# Altium schematic sheet [07]-PowerSupply.SchDoc: Powersupplies (part 2 of 4)
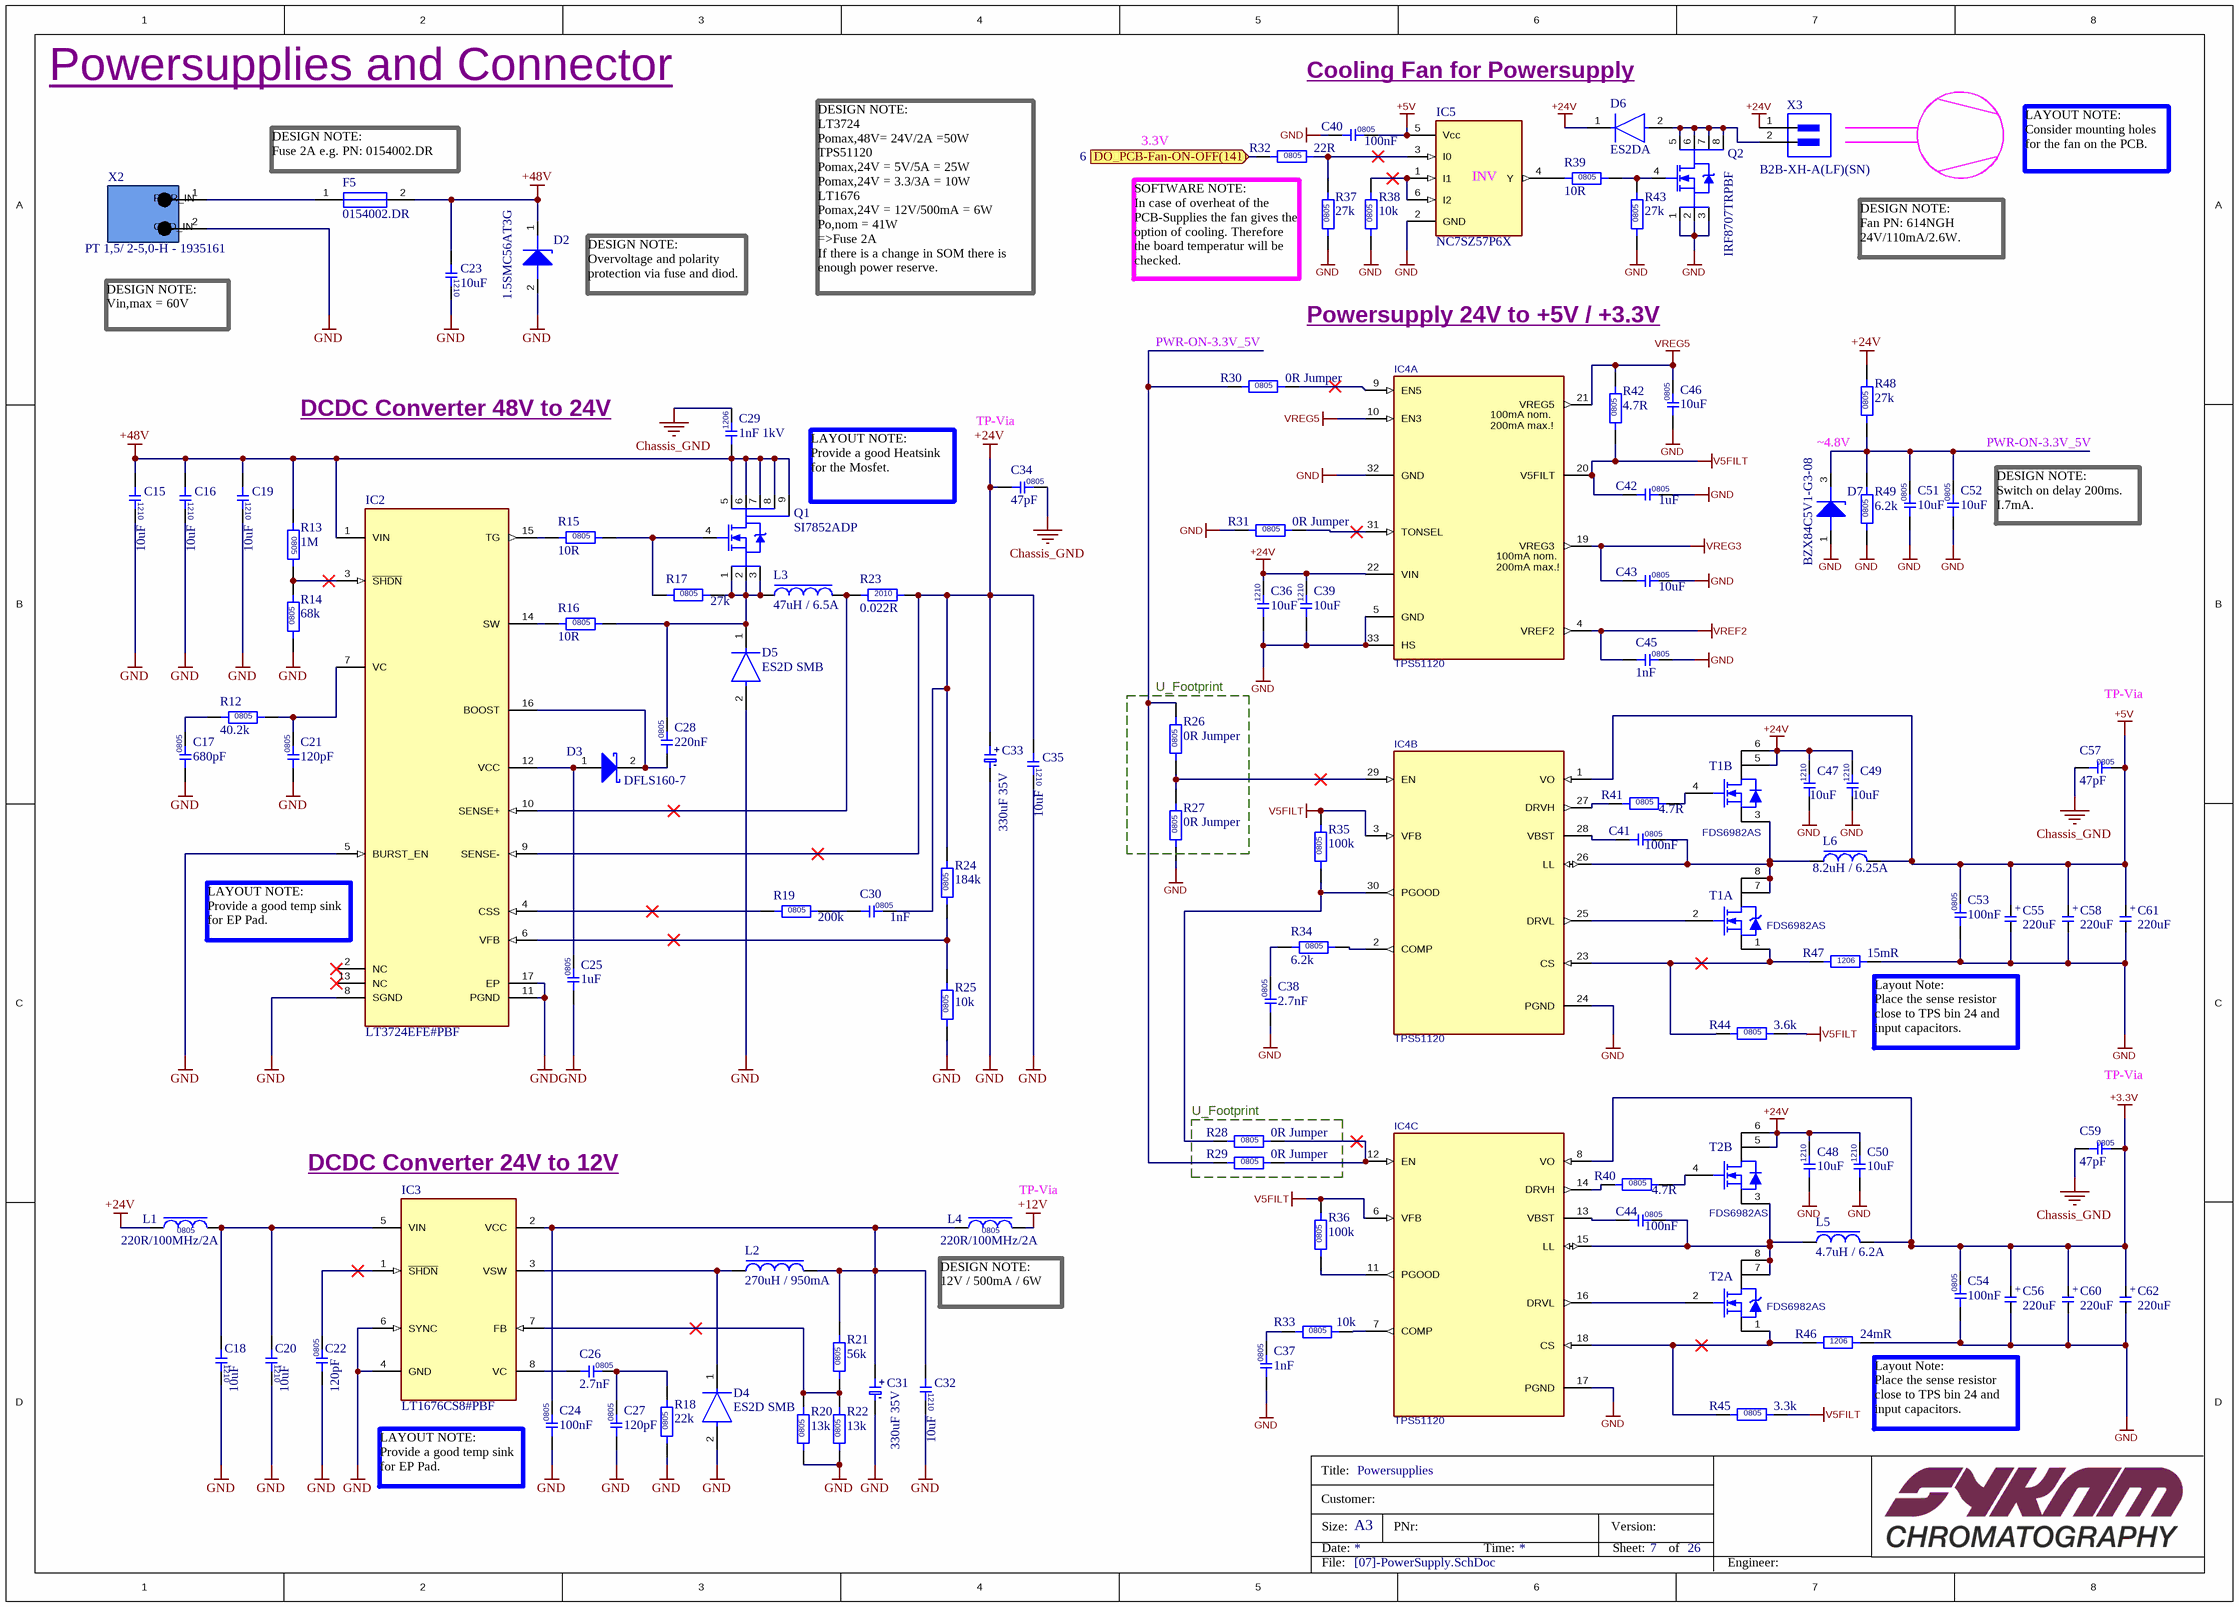
[diagram p1: [07]-PowerSupply.SchDoc]
## Library data of the parts
C15 C16 C18-C20 C23 C32 C35 C36 C39 C47-C50 = C_10uF_C1210C106K5RACTU: CAP CER 10UF 50V X7R 1210; Manufacturer: KEMET; Dielectric Material: Ceramic; Tolerance: 10%; Supplier 1: Digi-Key; Manufacturer Part Number: C1210C106K5RACTU; RoHS: Yes; Category: Ceramic Capacitors; Stock 1: 21988; Pricing 1: 1=0,90000, 10=0,66400, 100=0,45540, 500=0,36052 (USD); Mount: Surface Mount; Case/Package: 1210; Weight: 0.000564oz; Case Code (Metric): 3225; Case Code (Imperial): 1210; Min Operating Temperature: -55°C; Max Operating Temperature: 125°C; Packaging: Tape and Reel; Voltage Rating: 50V; Voltage: 50V; Dielectric: X7R; Termination: SMD/SMT; Voltage Rating (DC): 50V; Package Quantity: 1000; Capacitance: 10uF; Length: 3.2mm; Height: 2.5mm; Width: 2.5mm; Thickness: 0.11inch; Depth: 2.5mm; REACH SVHC: No SVHC; ComponentLink1URL: http://www.mouser.com/ds/2/212/KEM_C1002_X7R_SMD-357932.pdf?src-supplier=Mouser; ComponentLink1Description: http://www.mouser.com/ds/2/212/KEM_C1002_X7R_SMD-357932.pdf?src-supplier=Mouser; ComponentLink2URL: http://uk.rs-online.com/webdocs/1515/0900766b8151523b.pdf?src-supplier=RSComponents; ComponentLink2Description: http://uk.rs-online.com/webdocs/1515/0900766b8151523b.pdf?src-supplier=RSComponents; ComponentLink3URL: http://www.farnell.com/datasheets/2740742.pdf?src-supplier=Farnell; ComponentLink3Description: http://www.farnell.com/datasheets/2740742.pdf?src-supplier=Farnell; ComponentLink4URL: https://api.kemet.com/component-edge/download/datasheet/C1210C106K5RACTU.pdf?src-supplier=Digi-Key; ComponentLink4Description: https://api.kemet.com/component-edge/download/datasheet/C1210C106K5RACTU.pdf?src-supplier=Digi-Key; ComponentLink5URL: http://capacitoredge.kemet.com/capedge2/DataSheet/Datasheet-C0402C471J3GACTU.pdf?pn=C1210C106K5RACTU&src-supplier=Avnet; ComponentLink5Description: http://capacitoredge.kemet.com/capedge2/DataSheet/Datasheet-C0402C471J3GACTU.pdf?pn=C1210C106K5RACTU&src-supplier=Avnet; ComponentLink6URL: http://www.farnell.com/datasheets/2740742.pdf?src-supplier=Element14; ComponentLink6Description: http://www.farnell.com/datasheets/2740742.pdf?src-supplier=Element14; ComponentLink7URL: http://capacitoredge.kemet.com/capedge2/DataSheet/Datasheet-C1210C106K5RACTU.pdf?pn=C1210C106K5RACTU&src-supplier=Avnet; ComponentLink7Description: http://capacitoredge.kemet.com/capedge2/DataSheet/Datasheet-C1210C106K5RACTU.pdf?pn=C1210C106K5RACTU&src-supplier=Avnet; ComponentLink8URL: http://www.farnell.com/datasheets/1886292.pdf?src-supplier=Newark; ComponentLink8Description: http://www.farnell.com/datasheets/1886292.pdf?src-supplier=Newark; ComponentLink9URL: http://www.farnell.com/datasheets/2740742.pdf?src-supplier=Newark; ComponentLink9Description: http://www.farnell.com/datasheets/2740742.pdf?src-supplier=Newark; Supplier Part Number 1: 399-11629-1-ND
C17 = C_680pF_C0805C681K5RACTU: Cap Ceramic 680pF 50V X7R 10% SMD 0805 125C T/R; Manufacturer: KEMET; Dissipation Factor: 2.5%; Supplier 1: Farnell; Manufacturer Part Number: C0805C681K5RACTU; RoHS: Yes; Category: Ceramic Capacitors; Stock 1: 3684; Pricing 1: 10=0,16600, 100=0,10900, 500=0,07040, 1000=0,06490, 2000=0,05190 (EUR); Mount: Surface Mount,PCB; Case/Package: 0805; Case Code (Imperial): 0805; Case Code (Metric): 2012; Dielectric Material: Ceramic; Min Operating Temperature: -55°C; Max Operating Temperature: 125°C; Capacitance: 680pF; Tolerance: 10%; Packaging: Tape and Reel; Package Quantity: 1; Dielectric: X7R; Voltage Rating (DC): 50V; Termination: SMD/SMT; Voltage Rating: 50V; Voltage: 50V; Length: 2mm; Width: 1.2mm; Height: 0.78mm; Depth: 1.25mm; Thickness: 0.035inch; Lead Pitch: 0.75mm; Radiation Hardening: No; REACH SVHC: No SVHC; ComponentLink1URL: https://datasheet.ciiva.com/5424/kem-c1002-x7r-smd-357932-5424613.pdf?src-supplier=Mouser; ComponentLink1Description: https://datasheet.ciiva.com/5424/kem-c1002-x7r-smd-357932-5424613.pdf?src-supplier=Mouser; ComponentLink2URL: https://datasheet.ciiva.com/14598/70095383-14598986.pdf?src-supplier=Allied+Electronics; ComponentLink2Description: https://datasheet.ciiva.com/14598/70095383-14598986.pdf?src-supplier=Allied+Electronics; Supplier Part Number 1: 2581098
C21 C22 C27 = C_120pF_08055C121KAT2A: Cap Ceramic 120pF 50V X7R 10% SMD 0805 125C T/R; Manufacturer: Kyocera AVX; Supplier 1: Mouser; Manufacturer Part Number: 08055C121KAT2A; RoHS: Yes; Category: Ceramic Capacitors; Stock 1: 17744; Mount: Surface Mount; Case/Package: 0805; Number of Pins: 2; Case Code (Metric): 2012; Case Code (Imperial): 0805; Weight: 0.000194oz; Min Operating Temperature: -55°C; Max Operating Temperature: 125°C; Package Quantity: 4000; Capacitance: 120pF; Tolerance: 10%; Packaging: Tape and Reel; Voltage Rating (DC): 50V; Dielectric: X7R; Termination: SMD/SMT; Voltage Rating: 50V; Length: 2.01mm; Width: 0.049inch; Depth: 1.25mm; Thickness: 0.037inch; Lead Free: Lead Free; REACH SVHC: Unknown; ComponentLink1URL: https://datasheet.ciiva.com/205/cx7r-205216.pdf?src-supplier=Digi-Key; ComponentLink1Description: https://datasheet.ciiva.com/205/cx7r-205216.pdf?src-supplier=Digi-Key; Supplier Part Number 1: 581-08055C121KAT2A
C24 C40 C41 C44 C53 C54 = C_100nF_CC0805KRX7R9BB104: CAP CER 0.1UF 50V X7R 0805; Manufacturer: Yageo; Material: Ceramic; Tolerance: 10%; Insulation Resistance: 100GR; PCBChecked: initials after Checked; Supplier 1: Digi-Key; Manufacturer Part Number: CC0805KRX7R9BB104; RoHS: Yes; Category: Ceramic Capacitors; Mount: Surface Mount; Case/Package: 0805; Number of Pins: 2; Case Code (Metric): 2012; Case Code (Imperial): 0805; Min Operating Temperature: -55°C; Max Operating Temperature: 125°C; Packaging: Tape and Reel; Capacitance: 100nF; Voltage Rating: 50V; Package Quantity: 1; Dielectric: X7R; Termination: SMD/SMT; Voltage: 50V; Length: 2mm; Height: 0.85mm; Width: 0.049inch; Thickness: 0.033inch; Depth: 1.25mm; Radiation Hardening: No; REACH SVHC: No SVHC; Lead Free: Lead Free; Halogen Free: Halogen Free; ComponentLink1URL: https://datasheet.ciiva.com/11786/0900766b80d84f1d-11786009.pdf?src-supplier=RSComponents; ComponentLink1Description: https://datasheet.ciiva.com/11786/0900766b80d84f1d-11786009.pdf?src-supplier=RSComponents; ComponentLink2URL: https://datasheet.ciiva.com/11464/upy-gphc-x7r-6-3v-to-50v-8-11464757.pdf?src-supplier=Avnet; ComponentLink2Description: https://datasheet.ciiva.com/11464/upy-gphc-x7r-6-3v-to-50v-8-11464757.pdf?src-supplier=Avnet; ComponentLink3URL: https://datasheet.ciiva.com/28450/1489800-28450805.pdf?src-supplier=Element14; ComponentLink3Description: https://datasheet.ciiva.com/28450/1489800-28450805.pdf?src-supplier=Element14; ComponentLink4URL: https://datasheet.ciiva.com/155/mlccorderingcode-155929.pdf?src-supplier=Digi-Key; ComponentLink4Description: https://datasheet.ciiva.com/155/mlccorderingcode-155929.pdf?src-supplier=Digi-Key; ComponentLink5URL: https://datasheet.ciiva.com/155/mlccorderingcode-155930.pdf?src-supplier=Digi-Key; ComponentLink5Description: https://datasheet.ciiva.com/155/mlccorderingcode-155930.pdf?src-supplier=Digi-Key; ComponentLink6URL: https://datasheet.ciiva.com/155/mlccorderingcode-155931.pdf?src-supplier=Digi-Key; ComponentLink6Description: https://datasheet.ciiva.com/155/mlccorderingcode-155931.pdf?src-supplier=Digi-Key; ComponentLink7URL: https://datasheet.ciiva.com/46393/1734573-46393307.pdf?src-supplier=Element14; ComponentLink7Description: https://datasheet.ciiva.com/46393/1734573-46393307.pdf?src-supplier=Element14; ComponentLink8URL: https://datasheet.ciiva.com/16625/upy-gphc-x7r-6-3v-to-50v-8-16625549.pdf?src-supplier=Avnet+Europe; ComponentLink8Description: https://datasheet.ciiva.com/16625/upy-gphc-x7r-6-3v-to-50v-8-16625549.pdf?src-supplier=Avnet+Europe; ComponentLink9URL: https://datasheet.ciiva.com/29242/445210-da-01-en-kerko-chip-0805-x7r-0-1uf-10proz-50vg-29242074.pdf?src-supplier=Conrad; ComponentLink9Description: https://datasheet.ciiva.com/29242/445210-da-01-en-kerko-chip-0805-x7r-0-1uf-10proz-50vg-29242074.pdf?src-supplier=Conrad; Supplier Part Number 1: 311-1140-6-ND; Stock 1: 7118979; IPC7352C: done; SCHChecked: Initials after checked
C25 C42 = C_1uF_CC0805KKX7R9BB105: Cap Ceramic 1uF 50V X7R 10% SMD 0805 125C Blister T/R; Manufacturer: Yageo; PCBChecked: initials after Checked; Supplier 1: Digi-Key; Manufacturer Part Number: CC0805KKX7R9BB105; RoHS: Yes; Category: Ceramic Capacitors; Mount: Surface Mount; Case/Package: 0805; Weight: 0.000194oz; Case Code (Imperial): 0805; Case Code (Metric): 2012; Min Operating Temperature: -55°C; Max Operating Temperature: 125°C; Tolerance: 10%; Dielectric: X7R; Packaging: Tape and Reel; Capacitance: 1uF; Voltage Rating: 50V; Voltage Rating (DC): 50V; Termination: SMD/SMT; Composition: Ceramic; Length: 2mm; Height: 1.25mm; Width: 0.049inch; Thickness: 0.057inch; Depth: 1.25mm; Radiation Hardening: No; Lead Free: Lead Free; Halogen Free: Halogen Free; ComponentLink1URL: https://datasheet.ciiva.com/13209/upy-gphc-x7r-6-3v-to-50v-8-12304-13209375.pdf?src-supplier=Mouser; ComponentLink1Description: https://datasheet.ciiva.com/13209/upy-gphc-x7r-6-3v-to-50v-8-12304-13209375.pdf?src-supplier=Mouser; Supplier Part Number 1: 311-1886-6-ND; Stock 1: 325114; IPC7352C: done; SCHChecked: Initials after checked
C26 C38 = C_2.7nF_C0805C272K5RACTU: KEMET         C0805C272K5RACTU             SMD Multilayer Ceramic Capacitor, 0805 [2012 Metric], 2700 pF, 50 V,  10%, X7R, C Series; Voltage Rating: 50V; Dissipation Factor: 2.5%; Supplier 1: Digi-Key; Manufacturer: KEMET; Manufacturer Part Number: C0805C272K5RACTU; RoHS: Yes; Category: Ceramic Capacitors; Stock 1: 17634; Pricing 1: 1=0,21000, 10=0,14200, 100=0,07210, 500=0,04934, 1000=0,04364 (USD); Mount: Surface Mount,PCB; Case/Package: 0805; Number of Pins: 2; Dielectric Material: Ceramic; Case Code (Imperial): 0805; Case Code (Metric): 2012; Min Operating Temperature: -55°C; Max Operating Temperature: 125°C; Capacitance: 2.7nF; Tolerance: 10%; Packaging: Tape and Reel; Voltage Rating (DC): 50V; Dielectric: X7R; Termination: SMD/SMT; Package Quantity: 4000; Voltage: 50V; Length: 2mm; Height: 0.78mm; Width: 1.2mm; Lead Pitch: 0.75mm; Depth: 1.25mm; Thickness: 0.035inch; Radiation Hardening: No; REACH SVHC: No SVHC; ComponentLink1URL: https://datasheet.ciiva.com/14589/70095383-14589404.pdf?src-supplier=Allied+Electronics; ComponentLink1Description: https://datasheet.ciiva.com/14589/70095383-14589404.pdf?src-supplier=Allied+Electronics; Supplier Part Number 1: 399-1152-1-ND
C28 = C_220nF_C0805C224K5RACTU: CAP CER 0.22UF 50V X7R 0805; Manufacturer: KEMET; Dielectric Material: Ceramic; Tolerance: 10%; Dissipation Factor: 2.5%; Supplier 1: Digi-Key; Manufacturer Part Number: C0805C224K5RACTU; RoHS: Yes; Category: Ceramic Capacitors; Stock 1: 1337737; Pricing 1: 1=0,20000, 10=0,13900, 100=0,06550, 500=0,04592, 1000=0,03802 (USD); Mount: Surface Mount,PCB; Case/Package: 0805; Case Code (Metric): 2012; Case Code (Imperial): 0805; Min Operating Temperature: -55°C; Max Operating Temperature: 125°C; Package Quantity: 1; Capacitance: 220nF; Voltage Rating: 50V; Packaging: Tape and Reel; Voltage Rating (DC): 50V; Dielectric: X7R; Termination: SMD/SMT; Voltage: 50V; Length: 2mm; Height: 1.1mm; Width: 0.049inch; Thickness: 0.055inch; Lead Pitch: 0.75mm; Depth: 1.25mm; Radiation Hardening: No; REACH SVHC: No SVHC; ComponentLink1URL: https://datasheet.ciiva.com/7842/kem-c1002-x7r-smd-7842582.pdf?src-supplier=Element14; ComponentLink1Description: https://datasheet.ciiva.com/7842/kem-c1002-x7r-smd-7842582.pdf?src-supplier=Element14; ComponentLink2URL: https://datasheet.ciiva.com/18193/getdatasheetpartid-304413-18193686.pdf?src-supplier=Verical; ComponentLink2Description: https://datasheet.ciiva.com/18193/getdatasheetpartid-304413-18193686.pdf?src-supplier=Verical; ComponentLink3URL: https://datasheet.ciiva.com/28682/1851736-28682316.pdf?src-supplier=Element14; ComponentLink3Description: https://datasheet.ciiva.com/28682/1851736-28682316.pdf?src-supplier=Element14; Supplier Part Number 1: 399-3491-1-ND
C29 = C_1nF-1kV-CGA5F1X7S3A102M085AE: CAP CER 1000PF 1KV X7S 1206; Manufacturer: TDK; Tolerance: 20%; Supplier 1: Mouser; Manufacturer Part Number: CGA5F1X7S3A102M085AE; RoHS: Yes; Category: Ceramic Capacitors; Stock 1: 11858; Pricing 1: 1=0,94000, 10=0,71800, 100=0,51400, 500=0,39800, 1000=0,34300, 4000=0,25700 (USD); Mount: Surface Mount; Case/Package: 1206; Weight: 0.000571oz; Case Code (Imperial): 1206; Case Code (Metric): 3216; Min Operating Temperature: -55°C; Max Operating Temperature: 125°C; Features: Soft Termination; Dielectric: X7S; Package Quantity: 4000; Packaging: Tape and Reel; Capacitance: 1nF; Voltage Rating: 1kV; Termination: SMD/SMT; Voltage Rating (DC): 1kV; Length: 0.126inch; Height: 0.85mm; Width: 0.063inch; Thickness: 0.039inch; Ratings: AEC-Q200; ComponentLink1URL: http://www.mouser.com/ds/2/400/lcc_commercial_soft_en-775842.pdf?src-supplier=Mouser; ComponentLink1Description: http://www.mouser.com/ds/2/400/lcc_commercial_soft_en-775842.pdf?src-supplier=Mouser; ComponentLink2URL: https://product.tdk.com/info/en/catalog/spec/mlccspec_automotive_highvoltage_en.pdf?src-supplier=Digi-Key; ComponentLink2Description: https://product.tdk.com/info/en/catalog/spec/mlccspec_automotive_highvoltage_en.pdf?src-supplier=Digi-Key; ComponentLink3URL: https://product.tdk.com/info/en/catalog/datasheets/mlcc_automotive_highvoltage_en.pdf?src-supplier=Digi-Key; ComponentLink3Description: https://product.tdk.com/info/en/catalog/datasheets/mlcc_automotive_highvoltage_en.pdf?src-supplier=Digi-Key; ComponentLink4URL: http://product.tdk.com/capacitor/mlcc/en/documents/mlcc_automotive_soft_en.pdf?src-supplier=Avnet; ComponentLink4Description: http://product.tdk.com/capacitor/mlcc/en/documents/mlcc_automotive_soft_en.pdf?src-supplier=Avnet; Supplier Part Number 1: 810-CGA5F1X7S3A102ME
C30 C37 C45 = C_1nF_C0805C102K5RAC7411: Multilayer Ceramic Capacitors MLCC - SMD/SMT 50volts 1000pF X7R 10%; Manufacturer: KEMET; Voltage Rating: 50V; Manufacturer Part Number: C0805C102K5RAC7411; RoHS: Yes; Category: Ceramic Capacitors; Stock 1: 30000; Pricing 1: 15000=0,01862, 30000=0,01764 (USD); Mount: Surface Mount; Case/Package: 0805; Case Code (Metric): 2012; Case Code (Imperial): 0805; Dielectric Material: Ceramic; Min Operating Temperature: -55°C; Max Operating Temperature: 125°C; Termination: SMD/SMT; Capacitance: 1nF; Package Quantity: 15000; Voltage Rating (DC): 50V; Tolerance: 10%; Packaging: Tape and Reel; Dielectric: X7R; Length: 0.079inch; Height: 0.78mm; Thickness: 0.035inch; Width: 0.049inch; ComponentLink1URL: http://components.arrow.com/part/dataview/0323_00324664?src-supplier=Arrow+Europe; ComponentLink1Description: http://components.arrow.com/part/dataview/0323_00324664?src-supplier=Arrow+Europe; ComponentLink2URL: http://www.mouser.com/ds/2/212/KEM_C1002_X7R_SMD-1102033.pdf?src-supplier=Mouser; ComponentLink2Description: http://www.mouser.com/ds/2/212/KEM_C1002_X7R_SMD-1102033.pdf?src-supplier=Mouser; ComponentLink3URL: https://api.kemet.com/component-edge/download/datasheet/C0805C102K5RAC7411.pdf?src-supplier=Digi-Key; ComponentLink3Description: https://api.kemet.com/component-edge/download/datasheet/C0805C102K5RAC7411.pdf?src-supplier=Digi-Key; Supplier 1: Digi-Key
  C30: Supplier Part Number 1: 311-1127-1-ND
  C37 C45: Supplier Part Number 1: 399-7361-2-ND
C31 C33 = C_330uF_35V_EEEFP1V331AP: GLOVE, POLYAMIDE, L/FREE, PU, SIZE 6 - More Details; Manufacturer: Panasonic; Material: Aluminium; Ripple Current: 1.19A; ESR (Equivalent Series Resistance): 60mR; Tolerance: 20%; Polarity: Polar; Leakage Current: 115.5uA; Life (Hours): 2000Hour; Supplier 1: Farnell; Manufacturer Part Number: EEEFP1V331AP; RoHS: Yes; Category: Aluminum Electrolytic Capacitors; Stock 1: 7000; Pricing 1: 500=0,24100, 2500=0,22600 (EUR); Mount: Surface Mount,PCB; Case/Package: Radial; Number of Pins: 2; Dielectric Material: Aluminium; Contact Plating: Tin; Min Operating Temperature: -55°C; Max Operating Temperature: 105°C; Capacitance: 330uF; Termination: SMD/SMT; Voltage: 35V; Voltage Rating: 35V; Ripple Current (AC): 1.19A; Packaging: Tape and Reel; Voltage Rating (DC): 35V; Package Quantity: 500; Diameter: 10mm; Length: 10.5mm; Width: 10.3mm; Height: 10.2mm; Height - Seated (Max): 0.402inch; Lead Pitch: 4.6mm; Radiation Hardening: No; REACH SVHC: No SVHC; Lead Free: Lead Free; ComponentLink1URL: https://datasheet.ciiva.com/25613/0900766b80df09a1-25613928.pdf?src-supplier=RSComponents; ComponentLink1Description: https://datasheet.ciiva.com/25613/0900766b80df09a1-25613928.pdf?src-supplier=RSComponents; ComponentLink2URL: https://datasheet.ciiva.com/11777/0900766b80df09a1-11777338.pdf?src-supplier=RSComponents; ComponentLink2Description: https://datasheet.ciiva.com/11777/0900766b80df09a1-11777338.pdf?src-supplier=RSComponents; ComponentLink3URL: https://datasheet.ciiva.com/29313/444849-da-01-en-smd-elko-eeefp1v331ap-330uf-35v-105-29313972.pdf?src-supplier=Conrad; ComponentLink3Description: https://datasheet.ciiva.com/29313/444849-da-01-en-smd-elko-eeefp1v331ap-330uf-35v-105-29313972.pdf?src-supplier=Conrad; ComponentLink4URL: https://datasheet.ciiva.com/14600/70068195-14600453.pdf?src-supplier=Allied+Electronics; ComponentLink4Description: https://datasheet.ciiva.com/14600/70068195-14600453.pdf?src-supplier=Allied+Electronics; ComponentLink5URL: https://datasheet.ciiva.com/30151/aba0000ce114-30151389.pdf?src-supplier=Onlinecomponents.com; ComponentLink5Description: https://datasheet.ciiva.com/30151/aba0000ce114-30151389.pdf?src-supplier=Onlinecomponents.com; ComponentLink6URL: https://datasheet.ciiva.com/2985/aba0000ce114-2985550.pdf?src-supplier=Avnet; ComponentLink6Description: https://datasheet.ciiva.com/2985/aba0000ce114-2985550.pdf?src-supplier=Avnet; ComponentLink7URL: https://datasheet.ciiva.com/24028/aba0000ce114-40714-24028182.pdf?src-supplier=Mouser; ComponentLink7Description: https://datasheet.ciiva.com/24028/aba0000ce114-40714-24028182.pdf?src-supplier=Mouser; ComponentLink8URL: https://datasheet.ciiva.com/46386/370232-46386774.pdf?src-supplier=Element14; ComponentLink8Description: https://datasheet.ciiva.com/46386/370232-46386774.pdf?src-supplier=Element14; ComponentLink9URL: https://datasheet.ciiva.com/46385/370232-46385482.pdf?src-supplier=Element14; ComponentLink9Description: https://datasheet.ciiva.com/46385/370232-46385482.pdf?src-supplier=Element14; ComponentLink10URL: https://datasheet.ciiva.com/48523/fp-eng-tds-48523850.pdf?src-supplier=Distrelec; ComponentLink10Description: https://datasheet.ciiva.com/48523/fp-eng-tds-48523850.pdf?src-supplier=Distrelec; ComponentLink11URL: https://datasheet.ciiva.com/10327/aba0000ce114-10327227.pdf?src-supplier=Avnet; ComponentLink11Description: https://datasheet.ciiva.com/10327/aba0000ce114-10327227.pdf?src-supplier=Avnet; ComponentLink12URL: https://datasheet.ciiva.com/14603/70068195-14603563.pdf?src-supplier=Allied+Electronics; ComponentLink12Description: https://datasheet.ciiva.com/14603/70068195-14603563.pdf?src-supplier=Allied+Electronics; ComponentLink13URL: https://datasheet.ciiva.com/17533/aba0000ce114-17533116.pdf?src-supplier=Avnet+Europe; ComponentLink13Description: https://datasheet.ciiva.com/17533/aba0000ce114-17533116.pdf?src-supplier=Avnet+Europe; ComponentLink14URL: https://datasheet.ciiva.com/28692/370232-28692654.pdf?src-supplier=Element14; ComponentLink14Description: https://datasheet.ciiva.com/28692/370232-28692654.pdf?src-supplier=Element14; Supplier Part Number 1: 2408633
C34 C57 C59 = C_47pF_C0805C470J1GACTU: Capacitor: ceramic; MLCC; 47pF; 100V; C0G; ±5%; SMD; 0805; Manufacturer: KEMET; Temperature Coefficient: 30ppm/°C; Supplier 1: Digi-Key; Manufacturer Part Number: C0805C470J1GACTU; RoHS: Yes; Category: Ceramic Capacitors; Mount: Surface Mount; Case/Package: 0805; Number of Pins: 2; Case Code (Metric): 2012; Case Code (Imperial): 0805; Contact Material: Tin; Dielectric Material: Ceramic; Min Operating Temperature: -55°C; Max Operating Temperature: 125°C; Capacitance: 47pF; Tolerance: 5%; Packaging: Tape and Reel; Voltage Rating: 100V; Package Quantity: 1; Voltage Rating (DC): 100V; Dielectric: C0G; Termination: SMD/SMT; Voltage: 100V; Length: 2mm; Height: 0.78mm; Width: 0.049inch; Thickness: 0.035inch; Lead Pitch: 0.75mm; Depth: 1.25mm; Radiation Hardening: No; REACH SVHC: No SVHC; Lead Free: Lead Free; ComponentLink1URL: https://datasheet.ciiva.com/28668/1789732-28668806.pdf?src-supplier=Element14; ComponentLink1Description: https://datasheet.ciiva.com/28668/1789732-28668806.pdf?src-supplier=Element14; ComponentLink2URL: https://datasheet.ciiva.com/7842/40889-7842330.pdf?src-supplier=Element14; ComponentLink2Description: https://datasheet.ciiva.com/7842/40889-7842330.pdf?src-supplier=Element14; ComponentLink3URL: https://datasheet.ciiva.com/22705/40889-22705466.pdf?src-supplier=Element14; ComponentLink3Description: https://datasheet.ciiva.com/22705/40889-22705466.pdf?src-supplier=Element14; ComponentLink4URL: https://datasheet.ciiva.com/11463/kem-c1003-c0g-smd-11463581.pdf?src-supplier=Avnet; ComponentLink4Description: https://datasheet.ciiva.com/11463/kem-c1003-c0g-smd-11463581.pdf?src-supplier=Avnet; ComponentLink5URL: https://datasheet.ciiva.com/16624/kem-c1003-c0g-smd-16624990.pdf?src-supplier=Avnet+Europe; ComponentLink5Description: https://datasheet.ciiva.com/16624/kem-c1003-c0g-smd-16624990.pdf?src-supplier=Avnet+Europe; Supplier Part Number 1: 399-8079-1-ND; Stock 1: 31116
C43 C46 C51 C52 = C_10uF_GRM21BR6YA106ME43L: 0805 10 uF 50 V ±20% Tolerance X5R Multilayer Ceramic Capacitor; Manufacturer: Murata; Voltage Rating: 35V; Supplier 1: Digi-Key; Manufacturer Part Number: GRM21BR6YA106ME43L; RoHS: Yes; Category: Ceramic Capacitors; Stock 1: 143980; Pricing 1: 1=0,48000, 10=0,33200, 100=0,19920, 500=0,14942, 1000=0,12617 (USD); Mount: Surface Mount; Case/Package: 0805; Weight: 0.000335oz; Case Code (Imperial): 0805; Case Code (Metric): 2012; Min Operating Temperature: -55°C; Max Operating Temperature: 85°C; Tolerance: 20%; Capacitance: 10uF; Packaging: Tape and Reel; Dielectric: X5R; Termination: SMD/SMT; Voltage Rating (DC): 35V; Package Quantity: 3000; Length: 0.079inch; Height: 1.25mm; Width: 0.049inch; Thickness: 0.057inch; ComponentLink1URL: http://www.mouser.com/ds/2/281/c02e-2905.pdf?src-supplier=Mouser; ComponentLink1Description: http://www.mouser.com/ds/2/281/c02e-2905.pdf?src-supplier=Mouser; ComponentLink2URL: http://search.murata.co.jp/Ceramy/image/img/A01X/G101/ENG/GRM21BR6YA106ME43-01.pdf?src-supplier=Digi-Key; ComponentLink2Description: http://search.murata.co.jp/Ceramy/image/img/A01X/G101/ENG/GRM21BR6YA106ME43-01.pdf?src-supplier=Digi-Key; Supplier Part Number 1: 490-10515-6-ND
C55 C56 C58 C60-C62 = C_220uF_TAN_TPSD227M010R0100: CAPACITOR, TANTALUM; Manufacturer: Kyocera AVX; Voltage Rating: 10V; Tolerance: 20%; ESR (Equivalent Series Resistance): 100mR; Ripple Current: 490uA; Leakage Current: 22uA; Polarity: Polar; Dissipation Factor: 8%; Supplier 1: Digi-Key; Manufacturer Part Number: TPSD227M010R0100; RoHS: Yes; Category: Tantalum Capacitors; Stock 1: 5000; Pricing 1: 1=2,79000, 10=2,25600, 100=1,72250 (USD); Mount: Surface Mount; Case/Package: 7343-31; Number of Pins: 2; Case Code (Metric): 7343; Case Code (Imperial): 2917; Dielectric Material: Tantalum; Min Operating Temperature: -55°C; Max Operating Temperature: 125°C; Package Quantity: 1; Capacitance: 220uF; Packaging: Tape and Reel; Termination: SMD/SMT; Features: General Purpose; Voltage Rating (DC): 10V; Length: 7.3mm; Height: 2.9mm; Width: 0.169inch; Height - Seated (Max): 0.122inch; Depth: 4.3mm; Radiation Hardening: No; REACH SVHC: No SVHC; Lead Free: Lead Free; ComponentLink1URL: https://datasheet.ciiva.com/27051/1154301-27051500.pdf?src-supplier=Jameco; ComponentLink1Description: https://datasheet.ciiva.com/27051/1154301-27051500.pdf?src-supplier=Jameco; ComponentLink2URL: https://datasheet.ciiva.com/26787/tpsd227m010r0100-26787075.pdf?src-supplier=IIIC; ComponentLink2Description: https://datasheet.ciiva.com/26787/tpsd227m010r0100-26787075.pdf?src-supplier=IIIC; ComponentLink3URL: https://datasheet.ciiva.com/265/tps-265200.pdf?src-supplier=Digi-Key; ComponentLink3Description: https://datasheet.ciiva.com/265/tps-265200.pdf?src-supplier=Digi-Key; ComponentLink4URL: https://datasheet.ciiva.com/265/tps-265201.pdf?src-supplier=Digi-Key; ComponentLink4Description: https://datasheet.ciiva.com/265/tps-265201.pdf?src-supplier=Digi-Key; ComponentLink5URL: https://datasheet.ciiva.com/265/tps-265199.pdf?src-supplier=Digi-Key; ComponentLink5Description: https://datasheet.ciiva.com/265/tps-265199.pdf?src-supplier=Digi-Key; ComponentLink6URL: https://datasheet.ciiva.com/5935/1441576-5935727.pdf?src-supplier=Farnell; ComponentLink6Description: https://datasheet.ciiva.com/5935/1441576-5935727.pdf?src-supplier=Farnell; Supplier Part Number 1: 478-4110-1-ND
D2 = D_TVS_1.5SMC56AT3G: TVS DIODE 47.8V 77V SMC; Manufacturer: ON Semiconductor; Peak Pulse Power: 1.5kW; Peak Pulse Current: 19.5A; Min Breakdown Voltage: 53.2V; Polarity: Unidirectional; Number of Channels: 1; Power Line Protection: No; Max Reverse Leakage Current: 5uA; Test Current: 1mA; Element Configuration: Single; ESD Protection: Yes; Max Breakdown Voltage: 58.8V; Working Voltage: 3.5V; Supplier 1: Mouser; Manufacturer Part Number: 1.5SMC56AT3G; RoHS: Yes; Category: TVS Diodes; Case/Package: SMC; Number of Pins: 2; Contact Plating: Tin,Matte; Min Operating Temperature: -65°C; Max Operating Temperature: 150°C; Clamping Voltage: 77V; Packaging: Tape and Reel; Reverse Standoff Voltage: 47.8V; Package Quantity: 1; Operating Supply Voltage: 47.8V; Max Surge Current: 19.5A; Breakdown Voltage: 53.2V; Number of Unidirectional Channels: 1; Resistor Type: Zener; Direction: Unidirectional; Reverse Breakdown Voltage: 53.2V; Number of Elements: 1; Leakage Current: 5uA; Termination: SMD/SMT; Power Dissipation: 1.5kW; Length: 0.279inch; Width: 0.24inch; Height: 0.095inch; Radiation Hardening: No; Lead Free: Lead Free; Halogen Free: Halogen Free; ComponentLink1URL: https://datasheet.ciiva.com/15143/getdatasheetpartid-40946-15143068.pdf?src-supplier=Verical; ComponentLink1Description: https://datasheet.ciiva.com/15143/getdatasheetpartid-40946-15143068.pdf?src-supplier=Verical; ComponentLink2URL: https://datasheet.ciiva.com/354/1-5smc6-8at3-d-354389.pdf?src-supplier=Digi-Key; ComponentLink2Description: https://datasheet.ciiva.com/354/1-5smc6-8at3-d-354389.pdf?src-supplier=Digi-Key; ComponentLink3URL: https://datasheet.ciiva.com/354/1-5smc6-8at3-d-354390.pdf?src-supplier=Digi-Key; ComponentLink3Description: https://datasheet.ciiva.com/354/1-5smc6-8at3-d-354390.pdf?src-supplier=Digi-Key; ComponentLink4URL: https://datasheet.ciiva.com/354/1-5smc6-8at3-d-354391.pdf?src-supplier=Digi-Key; ComponentLink4Description: https://datasheet.ciiva.com/354/1-5smc6-8at3-d-354391.pdf?src-supplier=Digi-Key; ComponentLink5URL: https://datasheet.ciiva.com/18434/70100223-18434600.pdf?src-supplier=Allied+Electronics; ComponentLink5Description: https://datasheet.ciiva.com/18434/70100223-18434600.pdf?src-supplier=Allied+Electronics; ComponentLink6URL: https://datasheet.ciiva.com/4509/1-5smc6-8at3-d-4509177.pdf?src-supplier=Mouser; ComponentLink6Description: https://datasheet.ciiva.com/4509/1-5smc6-8at3-d-4509177.pdf?src-supplier=Mouser; Supplier Part Number 1: 863-1.5SMC56AT3G
D3 = D_DFLS160-7: DIODES INC. - DFLS160-7 - Schottky Rectifier, 60 V, 1 A, Single, PowerDI 123, 2 Pins, 500 mV; Forward Voltage: 500mV; Forward Current: 1A; Peak Reverse Current: 100uA; Max Repetitive Reverse Voltage (Vrrm): 60V; Max Forward Surge Current (Ifsm): 50A; Polarity: Standard; Capacitance: 67pF; Supplier 1: Digi-Key; Manufacturer: Diodes; Manufacturer Part Number: DFLS160-7; RoHS: Yes; Category: Schottky Diodes; Stock 1: 95119; Pricing 1: 1=0,44000, 10=0,37900, 25=0,35360, 100=0,26260, 250=0,24948, 500=0,20504, 1000=0,16665 (USD); Mount: Surface Mount; Number of Pins: 2; Contact Plating: Tin,Matte; Min Operating Temperature: -65°C; Max Operating Temperature: 150°C; Packaging: Tape and Reel; Package Quantity: 3000; Average Rectified Current: 1A; Peak Non-Repetitive Surge Current: 50A; Termination: SMD/SMT; Element Configuration: Single; Voltage Rating (DC): 60V; Current Rating: 1A; Output Current: 1A; Max Reverse Voltage (DC): 60V; Length: 2.8mm; Height: 0.98mm; Width: 1.78mm; Radiation Hardening: No; REACH SVHC: No SVHC; Lead Free: Lead Free; ComponentLink1URL: https://datasheet.ciiva.com/22695/ds30548-22695808.pdf?src-supplier=Element14; ComponentLink1Description: https://datasheet.ciiva.com/22695/ds30548-22695808.pdf?src-supplier=Element14; ComponentLink2URL: https://datasheet.ciiva.com/8301/ds30548-8301937.pdf?src-supplier=Avnet; ComponentLink2Description: https://datasheet.ciiva.com/8301/ds30548-8301937.pdf?src-supplier=Avnet; ComponentLink3URL: https://datasheet.ciiva.com/16958/0900766b80e30da9-16958716.pdf?src-supplier=Allied+Electronics; ComponentLink3Description: https://datasheet.ciiva.com/16958/0900766b80e30da9-16958716.pdf?src-supplier=Allied+Electronics; ComponentLink4URL: https://datasheet.ciiva.com/4715/ds30548-86621-4715693.pdf?src-supplier=Mouser; ComponentLink4Description: https://datasheet.ciiva.com/4715/ds30548-86621-4715693.pdf?src-supplier=Mouser; ComponentLink5URL: https://datasheet.ciiva.com/26788/dfls160-7-26788782.pdf?src-supplier=IIIC; ComponentLink5Description: https://datasheet.ciiva.com/26788/dfls160-7-26788782.pdf?src-supplier=IIIC; ComponentLink6URL: https://datasheet.ciiva.com/25947/ds30548-25947253.pdf?src-supplier=Avnet+Europe; ComponentLink6Description: https://datasheet.ciiva.com/25947/ds30548-25947253.pdf?src-supplier=Avnet+Europe; ComponentLink7URL: https://datasheet.ciiva.com/16199/ds30548-16199750.pdf?src-supplier=Future+Electronics; ComponentLink7Description: https://datasheet.ciiva.com/16199/ds30548-16199750.pdf?src-supplier=Future+Electronics; ComponentLink8URL: https://datasheet.ciiva.com/914/ds30548-914331.pdf?src-supplier=Digi-Key; ComponentLink8Description: https://datasheet.ciiva.com/914/ds30548-914331.pdf?src-supplier=Digi-Key; ComponentLink9URL: https://datasheet.ciiva.com/914/ds30548-914332.pdf?src-supplier=Digi-Key; ComponentLink9Description: https://datasheet.ciiva.com/914/ds30548-914332.pdf?src-supplier=Digi-Key; ComponentLink10URL: https://datasheet.ciiva.com/914/ds30548-914333.pdf?src-supplier=Digi-Key; ComponentLink10Description: https://datasheet.ciiva.com/914/ds30548-914333.pdf?src-supplier=Digi-Key; ComponentLink11URL: https://datasheet.ciiva.com/7964/ds30548-7964253.pdf?src-supplier=Element14; ComponentLink11Description: https://datasheet.ciiva.com/7964/ds30548-7964253.pdf?src-supplier=Element14; Supplier Part Number 1: DFLS160DICT-ND
D4 D5 = D_ES2D-SMB: ON SEMICONDUCTOR - ES2D - Fast / Ultrafast Diode, 200 V, 2 A, Single, 900 mV, 20 ns, 50 A; Manufacturer: ON Semiconductor / Fairchild; Reverse Recovery Time: 20ns; Forward Voltage: 900mV; Forward Current: 2A; Max Repetitive Reverse Voltage (Vrrm): 200V; Peak Non-Repetitive Surge Current: 50A; Max Reverse Current: 10uA; Polarity: Standard; Capacitance: 18pF; Power Dissipation: 1.66W; Supplier 1: Farnell; Manufacturer Part Number: ES2D; RoHS: Yes; Category: Rectifier Diodes; Stock 1: 13736; Pricing 1: 5=0,28400, 50=0,20400, 100=0,12300, 500=0,09090, 1500=0,08910 (EUR); Mount: Surface Mount; Case/Package: SMB; Number of Pins: 2; Min Operating Temperature: -55°C; Max Operating Temperature: 150°C; Packaging: Tape and Reel; Element Configuration: Single; Average Rectified Current: 2A; Max Reverse Voltage (DC): 200V; Package Quantity: 1; Recovery Time: 20ns; Max Surge Current: 50A; Voltage Rating (DC): 200V; Current Rating: 2A; Output Current: 2A; Max Forward Surge Current (Ifsm): 50A; Reverse Voltage: 200V; Current: 2A; Voltage: 200V; Length: 4.75mm; Width: 3.95mm; Height: 2.45mm; Radiation Hardening: No; Lead Free: Lead Free; REACH SVHC: No SVHC; ComponentLink1URL: https://datasheet.ciiva.com/910/es2a-910816.pdf?src-supplier=Digi-Key; ComponentLink1Description: https://datasheet.ciiva.com/910/es2a-910816.pdf?src-supplier=Digi-Key; ComponentLink2URL: https://datasheet.ciiva.com/4452/es2d-182553-4452884.pdf?src-supplier=Mouser; ComponentLink2Description: https://datasheet.ciiva.com/4452/es2d-182553-4452884.pdf?src-supplier=Mouser; ComponentLink3URL: https://datasheet.ciiva.com/22651/1815144-22651957.pdf?src-supplier=Element14; ComponentLink3Description: https://datasheet.ciiva.com/22651/1815144-22651957.pdf?src-supplier=Element14; ComponentLink4URL: https://datasheet.ciiva.com/910/es2a-910815.pdf?src-supplier=Digi-Key; ComponentLink4Description: https://datasheet.ciiva.com/910/es2a-910815.pdf?src-supplier=Digi-Key; ComponentLink5URL: https://datasheet.ciiva.com/25951/es2d-25951462.pdf?src-supplier=Avnet+Europe; ComponentLink5Description: https://datasheet.ciiva.com/25951/es2d-25951462.pdf?src-supplier=Avnet+Europe; ComponentLink6URL: https://datasheet.ciiva.com/8303/es2d-8303722.pdf?src-supplier=Avnet; ComponentLink6Description: https://datasheet.ciiva.com/8303/es2d-8303722.pdf?src-supplier=Avnet; ComponentLink7URL: https://datasheet.ciiva.com/8303/es2d-8303485.pdf?src-supplier=Avnet; ComponentLink7Description: https://datasheet.ciiva.com/8303/es2d-8303485.pdf?src-supplier=Avnet; ComponentLink8URL: https://datasheet.ciiva.com/910/es2a-910814.pdf?src-supplier=Digi-Key; ComponentLink8Description: https://datasheet.ciiva.com/910/es2a-910814.pdf?src-supplier=Digi-Key; Supplier Part Number 1: 1467491
D6 = D_ES2DA-13-F: DIODE GEN PURP 200V 2A SMA; Manufacturer: Diodes; Reverse Recovery Time: 25ns; Element Configuration: Single; Forward Voltage: 920mV; Peak Non-Repetitive Surge Current: 50A; Peak Reverse Current: 5uA; Polarity: Standard; Capacitance: 25pF; Natural Thermal Resistance: 20°C/W; Number of Elements: 1; Supplier 1: Digi-Key; Manufacturer Part Number: ES2DA-13-F; RoHS: Yes; Category: Rectifier Diodes; Stock 1: 159412; Pricing 1: 1=0,47000, 10=0,38000, 25=0,34760, 100=0,21820, 250=0,21572, 500=0,20200, 1000=0,13736, 2500=0,13170 (USD); Mount: Surface Mount; Case/Package: SMA; Number of Pins: 2; Weight: 0.002258oz; Contact Plating: Tin,Matte; Number of Terminals: 2; Min Operating Temperature: -55°C; Max Operating Temperature: 150°C; Packaging: Tape and Reel; Forward Current: 2A; Max Repetitive Reverse Voltage (Vrrm): 200V; Average Rectified Current: 2A; Max Reverse Voltage (DC): 200V; Package Quantity: 5000; Recovery Time: 25ns; Voltage Rating (DC): 200V; Current Rating: 2A; Output Current: 2A; Max Surge Current: 50A; Termination: SMD/SMT; Reverse Voltage (DC): 200V; Length: 4.6mm; Height: 2.1mm; Width: 2.92mm; Radiation Hardening: No; Lead Free: Lead Free; ComponentLink1URL: https://datasheet.ciiva.com/34302/1590647-34302598.pdf?src-supplier=Jameco; ComponentLink1Description: https://datasheet.ciiva.com/34302/1590647-34302598.pdf?src-supplier=Jameco; ComponentLink2URL: https://datasheet.ciiva.com/15144/getdatasheetpartid-91735-15144695.pdf?src-supplier=Verical; ComponentLink2Description: https://datasheet.ciiva.com/15144/getdatasheetpartid-91735-15144695.pdf?src-supplier=Verical; ComponentLink3URL: https://datasheet.ciiva.com/16440/ds14002-16440105.pdf?src-supplier=Future+Electronics; ComponentLink3Description: https://datasheet.ciiva.com/16440/ds14002-16440105.pdf?src-supplier=Future+Electronics; ComponentLink4URL: https://datasheet.ciiva.com/913/ds14002-913853.pdf?src-supplier=Digi-Key; ComponentLink4Description: https://datasheet.ciiva.com/913/ds14002-913853.pdf?src-supplier=Digi-Key; ComponentLink5URL: https://datasheet.ciiva.com/913/ds14002-913854.pdf?src-supplier=Digi-Key; ComponentLink5Description: https://datasheet.ciiva.com/913/ds14002-913854.pdf?src-supplier=Digi-Key; ComponentLink6URL: https://datasheet.ciiva.com/913/ds14002-913855.pdf?src-supplier=Digi-Key; ComponentLink6Description: https://datasheet.ciiva.com/913/ds14002-913855.pdf?src-supplier=Digi-Key; Supplier Part Number 1: ES2DA-FDICT-ND
D7 = D_BZX84C5V1-G3-08: Zener Diodes 5.1 Volt 0.35W 5%; Manufacturer: Vishay; Zener Voltage: 5.1V; Power Dissipation: 300mW; Max Reverse Leakage Current: 2uA; Impedance: 60R; Element Configuration: Single; Supplier 1: Mouser; Manufacturer Part Number: BZX84C5V1-G3-08; RoHS: Yes; Category: Zener Diodes; Stock 1: 2798; Mount: Surface Mount; Case/Package: SOT-23-3; Weight: 0.00031oz; Min Operating Temperature: -55°C; Max Operating Temperature: 150°C; Packaging: Tape and Reel; Package Quantity: 3000; Voltage Tolerance: 5%; Max Power Dissipation: 300mW; Tolerance: 5%; RoHS Compliant: Yes; ComponentLink1URL: http://www.mouser.com/ds/2/427/bzx84-v--108145.pdf?src-supplier=Mouser; ComponentLink1Description: http://www.mouser.com/ds/2/427/bzx84-v--108145.pdf?src-supplier=Mouser; ComponentLink2URL: http://www.vishay.com/docs/83458/bzx84vg.pdf?src-supplier=Digi-Key; ComponentLink2Description: http://www.vishay.com/docs/83458/bzx84vg.pdf?src-supplier=Digi-Key; ComponentLink3URL: http://www.vishay.com/docs/85763/bzx84v.pdf?src-supplier=Avnet; ComponentLink3Description: http://www.vishay.com/docs/85763/bzx84v.pdf?src-supplier=Avnet; Supplier Part Number 1: 78-BZX84C5V1-G3-08
F5 = F_Fuse-0154002.DR: LITTELFUSE   0154002.DR.   FUSE BLOCK W/ 2A FUSE, FAST ACTING; Color: White; Body Material: Ceramic,Thermoplastic; Voltage Rating (AC): 125V; DC Cold Resistance: 36.7mR; Power Dissipation: 125W; Fuse Type: Board Mount (Cartridge Style Excluded); Approvals: UL,PSE; Supplier 1: Farnell; Manufacturer: Littelfuse; Manufacturer Part Number: 0154002.DR; RoHS: Yes; Category: Fuses; Stock 1: 3151; Pricing 1: 1=3,03000, 50=1,67000, 100=1,53000, 250=1,40000, 500=1,27000 (EUR); Mount: Surface Mount,Holder; Case/Package: SMD/SMT; Number of Pins: 2; Terminal Material: Copper; Min Operating Temperature: -55°C; Max Operating Temperature: 125°C; Current Rating: 2A; Packaging: Tape and Reel; Package Quantity: 1500; Voltage Rating (DC): 125V; Series: OMNI-BLOK® 154; Voltage Rating: 125V; Working Voltage: 125V; Fuse Current: 2A; Termination: SMD/SMT; Length: 9.73mm; Width: 5.03mm; Height: 3.81mm; Depth: 5.03mm; Size: 5.03mm; Radiation Hardening: No; RoHS Compliant: Yes; Lead Free: Lead Free; REACH SVHC: Unknown; Flammability Rating: UL94 V-0; ComponentLink1URL: https://datasheet.ciiva.com/34302/1708908-34302645.pdf?src-supplier=Jameco; ComponentLink1Description: https://datasheet.ciiva.com/34302/1708908-34302645.pdf?src-supplier=Jameco; ComponentLink2URL: https://datasheet.ciiva.com/1268/1840330-1268626.pdf?src-supplier=Element14; ComponentLink2Description: https://datasheet.ciiva.com/1268/1840330-1268626.pdf?src-supplier=Element14; ComponentLink3URL: https://datasheet.ciiva.com/15187/getdatasheetpartid-111161-15187895.pdf?src-supplier=Verical; ComponentLink3Description: https://datasheet.ciiva.com/15187/getdatasheetpartid-111161-15187895.pdf?src-supplier=Verical; ComponentLink4URL: https://datasheet.ciiva.com/28499/154-28499723.pdf?src-supplier=Element14; ComponentLink4Description: https://datasheet.ciiva.com/28499/154-28499723.pdf?src-supplier=Element14; ComponentLink5URL: https://datasheet.ciiva.com/46406/1840330-46406108.pdf?src-supplier=Element14; ComponentLink5Description: https://datasheet.ciiva.com/46406/1840330-46406108.pdf?src-supplier=Element14; ComponentLink6URL: https://datasheet.ciiva.com/14102/aa154xxx-data-e-14102958.pdf?src-supplier=Distrelec; ComponentLink6Description: https://datasheet.ciiva.com/14102/aa154xxx-data-e-14102958.pdf?src-supplier=Distrelec; ComponentLink7URL: https://datasheet.ciiva.com/22712/1840330-22712959.pdf?src-supplier=Element14; ComponentLink7Description: https://datasheet.ciiva.com/22712/1840330-22712959.pdf?src-supplier=Element14; ComponentLink8URL: https://datasheet.ciiva.com/28622/88932-28622783.pdf?src-supplier=Element14; ComponentLink8Description: https://datasheet.ciiva.com/28622/88932-28622783.pdf?src-supplier=Element14; Supplier Part Number 1: 9943641
IC2 = IC_LT3724EFE#PBF: LINEAR TECHNOLOGY 	   	LT3724EFE#PBF 	   	IC, SWITCHING REGULATOR CTRL, 16-TSSOP; Manufacturer: Analog Devices / Linear Technology; Output Current: 5A; Output Voltage: 36V; Max Supply Voltage: 60V; Min Supply Voltage: 4V; Number of Outputs: 1; Switching Frequency: 225kHz; Duty Cycle: 100%; Rise Time: 60ns; Max Duty Cycle: 99%; Topology: SEPIC; Supplier 1: Mouser; Manufacturer Part Number: LT3724EFE#PBF; RoHS: Yes; Category: Voltage Regulators - Switching; Stock 1: 488; Case/Package: TSSOP; Number of Pins: 16; Min Operating Temperature: -40°C; Max Operating Temperature: 125°C; Package Quantity: 95; Packaging: Rail/Tube; Max Frequency: 225kHz; Fall Time: 60ns; Length: 4.9mm; Width: 4.3mm; Height: 0.95mm; REACH SVHC: No SVHC; Lead Free: Lead Free; ComponentLink1URL: https://datasheet.ciiva.com/19474/1744431-19474006.pdf?src-supplier=Jameco; ComponentLink1Description: https://datasheet.ciiva.com/19474/1744431-19474006.pdf?src-supplier=Jameco; ComponentLink2URL: https://datasheet.ciiva.com/30476/0900766b812525b4-30476603.pdf?src-supplier=RSComponents; ComponentLink2Description: https://datasheet.ciiva.com/30476/0900766b812525b4-30476603.pdf?src-supplier=RSComponents; ComponentLink3URL: https://datasheet.ciiva.com/26893/lt3724efe-pbf-26893190.pdf?src-supplier=IIIC; ComponentLink3Description: https://datasheet.ciiva.com/26893/lt3724efe-pbf-26893190.pdf?src-supplier=IIIC; ComponentLink4URL: https://datasheet.ciiva.com/2019/7198-2019283.pdf?src-supplier=Digi-Key; ComponentLink4Description: https://datasheet.ciiva.com/2019/7198-2019283.pdf?src-supplier=Digi-Key; ComponentLink5URL: https://datasheet.ciiva.com/6192/1684151-6192730.pdf?src-supplier=Farnell; ComponentLink5Description: https://datasheet.ciiva.com/6192/1684151-6192730.pdf?src-supplier=Farnell; ComponentLink6URL: https://datasheet.ciiva.com/7905/1684151-7905901.pdf?src-supplier=Element14; ComponentLink6Description: https://datasheet.ciiva.com/7905/1684151-7905901.pdf?src-supplier=Element14; ComponentLink7URL: https://datasheet.ciiva.com/7363/1684151-7363598.pdf?src-supplier=Newark; ComponentLink7Description: https://datasheet.ciiva.com/7363/1684151-7363598.pdf?src-supplier=Newark; Supplier Part Number 1: 584-LT3724EFE#PBF
IC3 = IC_LT1676CS8#PBF: IC REG BUCK ADJ 0.55A 8SOIC; Manufacturer: Analog Devices / Linear Technology; Output Voltage: 51V; Output Current: 700mA; Number of Outputs: 1; Synchronous Rectifier: No; Output Type: Adjustable; Switching Frequency: 100kHz; Min Input Voltage: 7.4V; Max Input Voltage: 60V; Max Output Current: 1A; Min Output Voltage: 1.24V; Supplier 1: Mouser; Manufacturer Part Number: LT1676CS8#PBF; RoHS: Yes; Category: Voltage Regulators - Switching; Stock 1: 1339; Case/Package: SOIC; Number of Pins: 8; Min Operating Temperature: 0°C; Max Operating Temperature: 125°C; Package Quantity: 100; Packaging: Cut Tape; Max Output Voltage: 51V; Length: 5mm; Width: 3.988mm; Height: 1.498mm; Lead Free: Lead Free; REACH SVHC: No SVHC; ComponentLink1URL: https://datasheet.ciiva.com/14150/uclt1676-e-14150834.pdf?src-supplier=Distrelec; ComponentLink1Description: https://datasheet.ciiva.com/14150/uclt1676-e-14150834.pdf?src-supplier=Distrelec; ComponentLink2URL: https://datasheet.ciiva.com/30477/0900766b81222ba8-30477663.pdf?src-supplier=RSComponents; ComponentLink2Description: https://datasheet.ciiva.com/30477/0900766b81222ba8-30477663.pdf?src-supplier=RSComponents; ComponentLink3URL: https://datasheet.ciiva.com/29306/157632-da-01-en-ic-lt-1676-cs-8-sekundaer-regler-so8-29306806.pdf?src-supplier=Conrad; ComponentLink3Description: https://datasheet.ciiva.com/29306/157632-da-01-en-ic-lt-1676-cs-8-sekundaer-regler-so8-29306806.pdf?src-supplier=Conrad; ComponentLink4URL: https://datasheet.ciiva.com/7959/1563032-7959848.pdf?src-supplier=Element14; ComponentLink4Description: https://datasheet.ciiva.com/7959/1563032-7959848.pdf?src-supplier=Element14; ComponentLink5URL: https://datasheet.ciiva.com/6185/1563032-6185343.pdf?src-supplier=Farnell; ComponentLink5Description: https://datasheet.ciiva.com/6185/1563032-6185343.pdf?src-supplier=Farnell; ComponentLink6URL: https://datasheet.ciiva.com/2024/2721-2024827.pdf?src-supplier=Digi-Key; ComponentLink6Description: https://datasheet.ciiva.com/2024/2721-2024827.pdf?src-supplier=Digi-Key; ComponentLink7URL: https://datasheet.ciiva.com/7136/1563032-7136429.pdf?src-supplier=Newark; ComponentLink7Description: https://datasheet.ciiva.com/7136/1563032-7136429.pdf?src-supplier=Newark; Supplier Part Number 1: 584-LT1676CS8#PBF
IC4 = IC-TI-TPS51120: IC REG CTRLR BUCK 32QFN; Manufacturer Name: Texas Instruments; Manufacturer Part Number: TPS51120RHBT; Output Voltage: 5.5V; Number of Outputs: 2; Output Current: 20A; Switching Frequency: 580kHz; Max Input Voltage: 28V; Min Input Voltage: 4.5V; Quiescent Current: 750uA; Duty Cycle: 88%; Min Output Voltage: 1.05V; Manufacturer Part No.: TPS51120; Supplier 1: Farnell; Supplier Part Number 1: 3008676; Manufacturer: Texas Instruments; RoHS: Yes; Category: Voltage Regulators - Switching; Stock 1: 499; Pricing 1: 1=3,26000, 10=2,60000, 25=2,46000, 50=2,24000, 100=2,02000, 250=1,82000, 500=1,74000, 1000=1,53000 (EUR); Case/Package: VQFN EP; Number of Pins: 32; Weight: 0.002533oz; Min Operating Temperature: -40°C; Max Operating Temperature: 85°C; Package Quantity: 250; Packaging: Tape and Reel; Max Output Current: 20A; Max Frequency: 580kHz; Max Output Voltage: 5.5V; Max Duty Cycle: 88%; Operating Supply Current: 750uA; Operating Supply Voltage: 5.5V; Length: 5mm; Height: 0.9mm; Width: 5mm; Radiation Hardening: No; Lead Free: Lead Free; ComponentLink1URL: https://datasheet.ciiva.com/15113/getdatasheetpartid-48147-15113535.pdf?src-supplier=Verical; ComponentLink1Description: https://datasheet.ciiva.com/15113/getdatasheetpartid-48147-15113535.pdf?src-supplier=Verical; ComponentLink2URL: https://datasheet.ciiva.com/26910/tps51120rhbt-26910343.pdf?src-supplier=IIIC; ComponentLink2Description: https://datasheet.ciiva.com/26910/tps51120rhbt-26910343.pdf?src-supplier=IIIC; ComponentLink3URL: https://datasheet.ciiva.com/26250/tps51120-26250057.pdf?src-supplier=Avnet+Europe; ComponentLink3Description: https://datasheet.ciiva.com/26250/tps51120-26250057.pdf?src-supplier=Avnet+Europe; ComponentLink4URL: https://datasheet.ciiva.com/2077/tps51120-2077597.pdf?src-supplier=Digi-Key; ComponentLink4Description: https://datasheet.ciiva.com/2077/tps51120-2077597.pdf?src-supplier=Digi-Key; ComponentLink5URL: https://datasheet.ciiva.com/2077/tps51120-2077598.pdf?src-supplier=Digi-Key; ComponentLink5Description: https://datasheet.ciiva.com/2077/tps51120-2077598.pdf?src-supplier=Digi-Key; ComponentLink6URL: https://datasheet.ciiva.com/2077/tps51120-2077599.pdf?src-supplier=Digi-Key; ComponentLink6Description: https://datasheet.ciiva.com/2077/tps51120-2077599.pdf?src-supplier=Digi-Key
IC5 = IC_NC7SZ57P6X: FAIRCHILD SEMICONDUCTOR         NC7SZ57P6X.            Multi-Function Logic Gate, Configurable, Ultra High Speed, 3 Input, 32 mA, 1.65V to 5.5V, SC-70-6; Manufacturer: ON Semiconductor / Fairchild; High Level Output Current: -32mA; Low Level Output Current: 32mA; Number of Gates: 1; Propagation Delay: 14.5ns; Logic Function: Multi Function; Quiescent Current: 1uA; Number of Inputs: 2; Schmitt Trigger Input: Yes; PCBChecked: initials after Checked; Supplier 1: Digi-Key; Manufacturer Part Number: NC7SZ57P6X; RoHS: Yes; Category: Logic Gates; Mount: Surface Mount; Case/Package: SC; Number of Pins: 6; Weight: 0.028g; Number of Terminals: 6; Min Operating Temperature: -40°C; Max Operating Temperature: 85°C; Max Supply Voltage: 5.5V; Min Supply Voltage: 1.65V; Packaging: Tape and Reel; Number of Circuits: 1; Turn-On Delay Time: 14.5ns; Number of Outputs: 1; Number of Elements: 1; Output Current: 32mA; Package Quantity: 3000; Length: 2mm; Height: 1mm; Width: 1.25mm; Radiation Hardening: No; Lead Free: Lead Free; REACH SVHC: No SVHC; ComponentLink1URL: https://datasheet.ciiva.com/34301/874445-34301638.pdf?src-supplier=Jameco; ComponentLink1Description: https://datasheet.ciiva.com/34301/874445-34301638.pdf?src-supplier=Jameco; ComponentLink2URL: https://datasheet.ciiva.com/25628/0900766b80f9b61c-25628492.pdf?src-supplier=RSComponents; ComponentLink2Description: https://datasheet.ciiva.com/25628/0900766b80f9b61c-25628492.pdf?src-supplier=RSComponents; ComponentLink3URL: https://datasheet.ciiva.com/15090/getdatasheetpartid-53023-15090335.pdf?src-supplier=Verical; ComponentLink3Description: https://datasheet.ciiva.com/15090/getdatasheetpartid-53023-15090335.pdf?src-supplier=Verical; ComponentLink4URL: https://datasheet.ciiva.com/1880/nc7sz57-1880020.pdf?src-supplier=Digi-Key; ComponentLink4Description: https://datasheet.ciiva.com/1880/nc7sz57-1880020.pdf?src-supplier=Digi-Key; ComponentLink5URL: https://datasheet.ciiva.com/8249/nc7sz57-8249558.pdf?src-supplier=Avnet; ComponentLink5Description: https://datasheet.ciiva.com/8249/nc7sz57-8249558.pdf?src-supplier=Avnet; ComponentLink6URL: https://datasheet.ciiva.com/16503/nc7sz57-16503560.pdf?src-supplier=Avnet+Asia; ComponentLink6Description: https://datasheet.ciiva.com/16503/nc7sz57-16503560.pdf?src-supplier=Avnet+Asia; ComponentLink7URL: https://datasheet.ciiva.com/1880/nc7sz57-1880021.pdf?src-supplier=Digi-Key; ComponentLink7Description: https://datasheet.ciiva.com/1880/nc7sz57-1880021.pdf?src-supplier=Digi-Key; ComponentLink8URL: https://datasheet.ciiva.com/7970/1727673-7970677.pdf?src-supplier=Element14; ComponentLink8Description: https://datasheet.ciiva.com/7970/1727673-7970677.pdf?src-supplier=Element14; ComponentLink9URL: https://datasheet.ciiva.com/1880/nc7sz57-1880022.pdf?src-supplier=Digi-Key; ComponentLink9Description: https://datasheet.ciiva.com/1880/nc7sz57-1880022.pdf?src-supplier=Digi-Key; ComponentLink10URL: https://datasheet.ciiva.com/16977/nc7sz57-16977945.pdf?src-supplier=Future+Electronics; ComponentLink10Description: https://datasheet.ciiva.com/16977/nc7sz57-16977945.pdf?src-supplier=Future+Electronics; Supplier Part Number 1: NC7SZ57P6XCT-ND; Stock 1: 16277; IPC7352C: done; SCHChecked: Initials after checked